# Altium project MAINBOARD.PrjPcb (part 2 of 2)

## Sheet CONNECTORs.SchDoc
size 299 x 400 mm
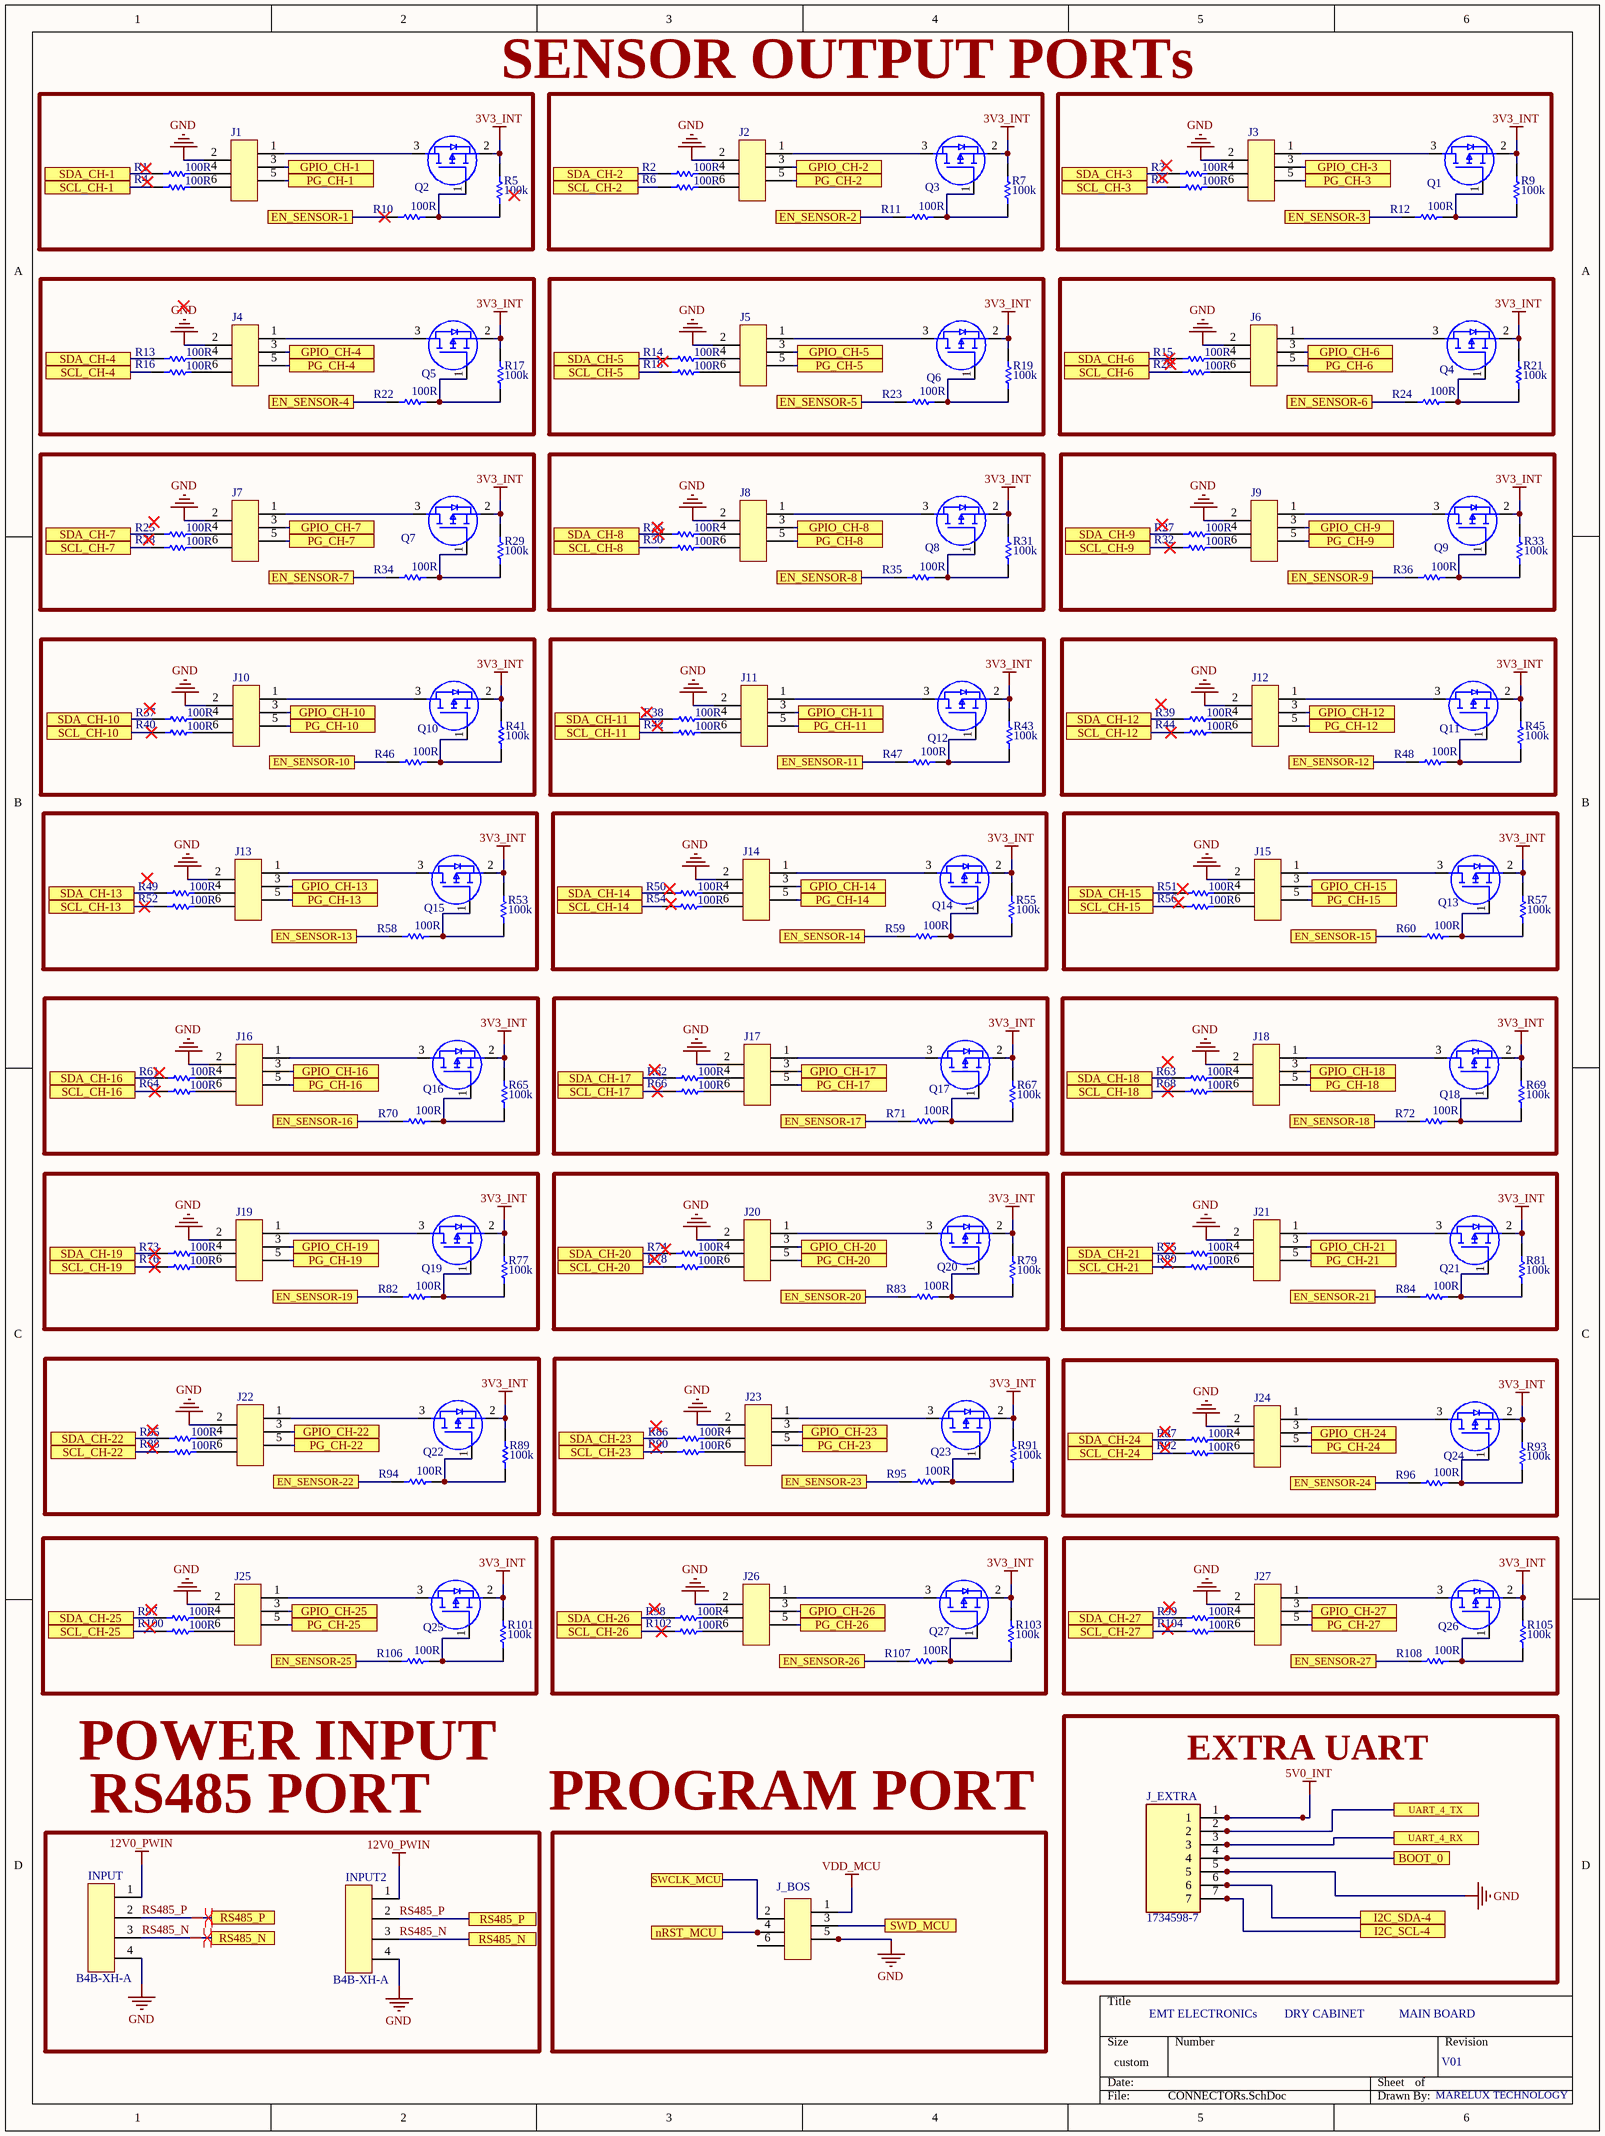
[diagram p8: CONNECTORs.SchDoc]

### Parts
INPUT  B4B-XH-A  [B4B-XH-A]
INPUT2  B4B-XH-A  [B4B-XH-A]
J1  009159006651906  [009159006651906]  (value not drawn)
J2  009159006651906  [009159006651906]  (value not drawn)
J3  009159006651906  [009159006651906]  (value not drawn)
J4  009159006651906  [009159006651906]  (value not drawn)
J5  009159006651906  [009159006651906]  (value not drawn)
J6  009159006651906  [009159006651906]  (value not drawn)
J7  009159006651906  [009159006651906]  (value not drawn)
J8  009159006651906  [009159006651906]  (value not drawn)
J9  009159006651906  [009159006651906]  (value not drawn)
J10  009159006651906  [009159006651906]  (value not drawn)
J11  009159006651906  [009159006651906]  (value not drawn)
J12  009159006651906  [009159006651906]  (value not drawn)
J13  009159006651906  [009159006651906]  (value not drawn)
J14  009159006651906  [009159006651906]  (value not drawn)
J15  009159006651906  [009159006651906]  (value not drawn)
J16  009159006651906  [009159006651906]  (value not drawn)
J17  009159006651906  [009159006651906]  (value not drawn)
J18  009159006651906  [009159006651906]  (value not drawn)
J19  009159006651906  [009159006651906]  (value not drawn)
J20  009159006651906  [009159006651906]  (value not drawn)
J21  009159006651906  [009159006651906]  (value not drawn)
J22  009159006651906  [009159006651906]  (value not drawn)
J23  009159006651906  [009159006651906]  (value not drawn)
J24  009159006651906  [009159006651906]  (value not drawn)
J25  009159006651906  [009159006651906]  (value not drawn)
J26  009159006651906  [009159006651906]  (value not drawn)
J27  009159006651906  [009159006651906]  (value not drawn)
J_BOS  009159006651906  [009159006651906]  (value not drawn)
J_EXTRA  1734598-7  [TE_1734598-7]
Q1  GSF3407  [SOT-23]  (value not drawn)
Q2  GSF3407  [SOT-23]  (value not drawn)
Q3  GSF3407  [SOT-23]  (value not drawn)
Q4  GSF3407  [SOT-23]  (value not drawn)
Q5  GSF3407  [SOT-23]  (value not drawn)
Q6  GSF3407  [SOT-23]  (value not drawn)
Q7  GSF3407  [SOT-23]  (value not drawn)
Q8  GSF3407  [SOT-23]  (value not drawn)
Q9  GSF3407  [SOT-23]  (value not drawn)
Q10  GSF3407  [SOT-23]  (value not drawn)
Q11  GSF3407  [SOT-23]  (value not drawn)
Q12  GSF3407  [SOT-23]  (value not drawn)
Q13  GSF3407  [SOT-23]  (value not drawn)
Q14  GSF3407  [SOT-23]  (value not drawn)
Q15  GSF3407  [SOT-23]  (value not drawn)
Q16  GSF3407  [SOT-23]  (value not drawn)
Q17  GSF3407  [SOT-23]  (value not drawn)
Q18  GSF3407  [SOT-23]  (value not drawn)
Q19  GSF3407  [SOT-23]  (value not drawn)
Q20  GSF3407  [SOT-23]  (value not drawn)
Q21  GSF3407  [SOT-23]  (value not drawn)
Q22  GSF3407  [SOT-23]  (value not drawn)
Q23  GSF3407  [SOT-23]  (value not drawn)
Q24  GSF3407  [SOT-23]  (value not drawn)
Q25  GSF3407  [SOT-23]  (value not drawn)
Q26  GSF3407  [SOT-23]  (value not drawn)
Q27  GSF3407  [SOT-23]  (value not drawn)
R1  value 100R  [RES_0402_SMD]  (hidden comment: RMCF0402JT100R)
R2  value 100R  [RES_0402_SMD]  (hidden comment: RMCF0402JT100R)
R3  value 100R  [RES_0402_SMD]  (hidden comment: RMCF0402JT100R)
R4  value 100R  [RES_0402_SMD]  (hidden comment: RMCF0402JT100R)
R5  value 100k  [RES_0402_SMD]  (hidden comment: RMCF0402JT100K)
R6  value 100R  [RES_0402_SMD]  (hidden comment: RMCF0402JT100R)
R7  value 100k  [RES_0402_SMD]  (hidden comment: RMCF0402JT100K)
R8  value 100R  [RES_0402_SMD]  (hidden comment: RMCF0402JT100R)
R9  value 100k  [RES_0402_SMD]  (hidden comment: RMCF0402JT100K)
R10  value 100R  [RES_0402_SMD]  (hidden comment: RMCF0402JT100R)
R11  value 100R  [RES_0402_SMD]  (hidden comment: RMCF0402JT100R)
R12  value 100R  [RES_0402_SMD]  (hidden comment: RMCF0402JT100R)
R13  value 100R  [RES_0402_SMD]  (hidden comment: RMCF0402JT100R)
R14  value 100R  [RES_0402_SMD]  (hidden comment: RMCF0402JT100R)
R15  value 100R  [RES_0402_SMD]  (hidden comment: RMCF0402JT100R)
R16  value 100R  [RES_0402_SMD]  (hidden comment: RMCF0402JT100R)
R17  value 100k  [RES_0402_SMD]  (hidden comment: RMCF0402JT100K)
R18  value 100R  [RES_0402_SMD]  (hidden comment: RMCF0402JT100R)
R19  value 100k  [RES_0402_SMD]  (hidden comment: RMCF0402JT100K)
R20  value 100R  [RES_0402_SMD]  (hidden comment: RMCF0402JT100R)
R21  value 100k  [RES_0402_SMD]  (hidden comment: RMCF0402JT100K)
R22  value 100R  [RES_0402_SMD]  (hidden comment: RMCF0402JT100R)
R23  value 100R  [RES_0402_SMD]  (hidden comment: RMCF0402JT100R)
R24  value 100R  [RES_0402_SMD]  (hidden comment: RMCF0402JT100R)
R25  value 100R  [RES_0402_SMD]  (hidden comment: RMCF0402JT100R)
R26  value 100R  [RES_0402_SMD]  (hidden comment: RMCF0402JT100R)
R27  value 100R  [RES_0402_SMD]  (hidden comment: RMCF0402JT100R)
R28  value 100R  [RES_0402_SMD]  (hidden comment: RMCF0402JT100R)
R29  value 100k  [RES_0402_SMD]  (hidden comment: RMCF0402JT100K)
R30  value 100R  [RES_0402_SMD]  (hidden comment: RMCF0402JT100R)
R31  value 100k  [RES_0402_SMD]  (hidden comment: RMCF0402JT100K)
R32  value 100R  [RES_0402_SMD]  (hidden comment: RMCF0402JT100R)
R33  value 100k  [RES_0402_SMD]  (hidden comment: RMCF0402JT100K)
R34  value 100R  [RES_0402_SMD]  (hidden comment: RMCF0402JT100R)
R35  value 100R  [RES_0402_SMD]  (hidden comment: RMCF0402JT100R)
R36  value 100R  [RES_0402_SMD]  (hidden comment: RMCF0402JT100R)
R37  value 100R  [RES_0402_SMD]  (hidden comment: RMCF0402JT100R)
R38  value 100R  [RES_0402_SMD]  (hidden comment: RMCF0402JT100R)
R39  value 100R  [RES_0402_SMD]  (hidden comment: RMCF0402JT100R)
R40  value 100R  [RES_0402_SMD]  (hidden comment: RMCF0402JT100R)
R41  value 100k  [RES_0402_SMD]  (hidden comment: RMCF0402JT100K)
R42  value 100R  [RES_0402_SMD]  (hidden comment: RMCF0402JT100R)
R43  value 100k  [RES_0402_SMD]  (hidden comment: RMCF0402JT100K)
R44  value 100R  [RES_0402_SMD]  (hidden comment: RMCF0402JT100R)
R45  value 100k  [RES_0402_SMD]  (hidden comment: RMCF0402JT100K)
R46  value 100R  [RES_0402_SMD]  (hidden comment: RMCF0402JT100R)
R47  value 100R  [RES_0402_SMD]  (hidden comment: RMCF0402JT100R)
R48  value 100R  [RES_0402_SMD]  (hidden comment: RMCF0402JT100R)
R49  value 100R  [RES_0402_SMD]  (hidden comment: RMCF0402JT100R)
R50  value 100R  [RES_0402_SMD]  (hidden comment: RMCF0402JT100R)
R51  value 100R  [RES_0402_SMD]  (hidden comment: RMCF0402JT100R)
R52  value 100R  [RES_0402_SMD]  (hidden comment: RMCF0402JT100R)
R53  value 100k  [RES_0402_SMD]  (hidden comment: RMCF0402JT100K)
R54  value 100R  [RES_0402_SMD]  (hidden comment: RMCF0402JT100R)
R55  value 100k  [RES_0402_SMD]  (hidden comment: RMCF0402JT100K)
R56  value 100R  [RES_0402_SMD]  (hidden comment: RMCF0402JT100R)
R57  value 100k  [RES_0402_SMD]  (hidden comment: RMCF0402JT100K)
R58  value 100R  [RES_0402_SMD]  (hidden comment: RMCF0402JT100R)
R59  value 100R  [RES_0402_SMD]  (hidden comment: RMCF0402JT100R)
R60  value 100R  [RES_0402_SMD]  (hidden comment: RMCF0402JT100R)
R61  value 100R  [RES_0402_SMD]  (hidden comment: RMCF0402JT100R)
R62  value 100R  [RES_0402_SMD]  (hidden comment: RMCF0402JT100R)
R63  value 100R  [RES_0402_SMD]  (hidden comment: RMCF0402JT100R)
R64  value 100R  [RES_0402_SMD]  (hidden comment: RMCF0402JT100R)
R65  value 100k  [RES_0402_SMD]  (hidden comment: RMCF0402JT100K)
R66  value 100R  [RES_0402_SMD]  (hidden comment: RMCF0402JT100R)
R67  value 100k  [RES_0402_SMD]  (hidden comment: RMCF0402JT100K)
R68  value 100R  [RES_0402_SMD]  (hidden comment: RMCF0402JT100R)
R69  value 100k  [RES_0402_SMD]  (hidden comment: RMCF0402JT100K)
R70  value 100R  [RES_0402_SMD]  (hidden comment: RMCF0402JT100R)
R71  value 100R  [RES_0402_SMD]  (hidden comment: RMCF0402JT100R)
R72  value 100R  [RES_0402_SMD]  (hidden comment: RMCF0402JT100R)
R73  value 100R  [RES_0402_SMD]  (hidden comment: RMCF0402JT100R)
R74  value 100R  [RES_0402_SMD]  (hidden comment: RMCF0402JT100R)
R75  value 100R  [RES_0402_SMD]  (hidden comment: RMCF0402JT100R)
R76  value 100R  [RES_0402_SMD]  (hidden comment: RMCF0402JT100R)
R77  value 100k  [RES_0402_SMD]  (hidden comment: RMCF0402JT100K)
R78  value 100R  [RES_0402_SMD]  (hidden comment: RMCF0402JT100R)
R79  value 100k  [RES_0402_SMD]  (hidden comment: RMCF0402JT100K)
R80  value 100R  [RES_0402_SMD]  (hidden comment: RMCF0402JT100R)
R81  value 100k  [RES_0402_SMD]  (hidden comment: RMCF0402JT100K)
R82  value 100R  [RES_0402_SMD]  (hidden comment: RMCF0402JT100R)
R83  value 100R  [RES_0402_SMD]  (hidden comment: RMCF0402JT100R)
R84  value 100R  [RES_0402_SMD]  (hidden comment: RMCF0402JT100R)
R85  value 100R  [RES_0402_SMD]  (hidden comment: RMCF0402JT100R)
R86  value 100R  [RES_0402_SMD]  (hidden comment: RMCF0402JT100R)
R87  value 100R  [RES_0402_SMD]  (hidden comment: RMCF0402JT100R)
R88  value 100R  [RES_0402_SMD]  (hidden comment: RMCF0402JT100R)
R89  value 100k  [RES_0402_SMD]  (hidden comment: RMCF0402JT100K)
R90  value 100R  [RES_0402_SMD]  (hidden comment: RMCF0402JT100R)
R91  value 100k  [RES_0402_SMD]  (hidden comment: RMCF0402JT100K)
R92  value 100R  [RES_0402_SMD]  (hidden comment: RMCF0402JT100R)
R93  value 100k  [RES_0402_SMD]  (hidden comment: RMCF0402JT100K)
R94  value 100R  [RES_0402_SMD]  (hidden comment: RMCF0402JT100R)
R95  value 100R  [RES_0402_SMD]  (hidden comment: RMCF0402JT100R)
R96  value 100R  [RES_0402_SMD]  (hidden comment: RMCF0402JT100R)
R97  value 100R  [RES_0402_SMD]  (hidden comment: RMCF0402JT100R)
R98  value 100R  [RES_0402_SMD]  (hidden comment: RMCF0402JT100R)
R99  value 100R  [RES_0402_SMD]  (hidden comment: RMCF0402JT100R)
R100  value 100R  [RES_0402_SMD]  (hidden comment: RMCF0402JT100R)
R101  value 100k  [RES_0402_SMD]  (hidden comment: RMCF0402JT100K)
R102  value 100R  [RES_0402_SMD]  (hidden comment: RMCF0402JT100R)
R103  value 100k  [RES_0402_SMD]  (hidden comment: RMCF0402JT100K)
R104  value 100R  [RES_0402_SMD]  (hidden comment: RMCF0402JT100R)
R105  value 100k  [RES_0402_SMD]  (hidden comment: RMCF0402JT100K)
R106  value 100R  [RES_0402_SMD]  (hidden comment: RMCF0402JT100R)
R107  value 100R  [RES_0402_SMD]  (hidden comment: RMCF0402JT100R)
R108  value 100R  [RES_0402_SMD]  (hidden comment: RMCF0402JT100R)

### Blocks framed on the sheet
SENSOR OUTPUT PORTs: J1 Q2 R1 R4 R5 R10
EXTRA UART: J_EXTRA
RS485 PORT: INPUT INPUT2

### Ports
BOOT_0, EN_SENSOR-1, EN_SENSOR-2, EN_SENSOR-3, EN_SENSOR-4, EN_SENSOR-5, EN_SENSOR-6, EN_SENSOR-7, EN_SENSOR-8, EN_SENSOR-9, EN_SENSOR-10, EN_SENSOR-11, EN_SENSOR-12, EN_SENSOR-13, EN_SENSOR-14, EN_SENSOR-15, EN_SENSOR-16, EN_SENSOR-17, EN_SENSOR-18, EN_SENSOR-19, EN_SENSOR-20, EN_SENSOR-21, EN_SENSOR-22, EN_SENSOR-23, EN_SENSOR-24, EN_SENSOR-25, EN_SENSOR-26, EN_SENSOR-27, GPIO_CH-1, GPIO_CH-2, GPIO_CH-3, GPIO_CH-4, GPIO_CH-5, GPIO_CH-6, GPIO_CH-7, GPIO_CH-8, GPIO_CH-9, GPIO_CH-10, GPIO_CH-11, GPIO_CH-12, GPIO_CH-13, GPIO_CH-14, GPIO_CH-15, GPIO_CH-16, GPIO_CH-17, GPIO_CH-18, GPIO_CH-19, GPIO_CH-20, GPIO_CH-21, GPIO_CH-22, GPIO_CH-23, GPIO_CH-24, GPIO_CH-25, GPIO_CH-26, GPIO_CH-27, I2C_SCL-4, I2C_SDA-4, nRST_MCU, PG_CH-1, PG_CH-2, PG_CH-3, PG_CH-4, PG_CH-5, PG_CH-6, PG_CH-7, PG_CH-8, PG_CH-9, PG_CH-10, PG_CH-11, PG_CH-12, PG_CH-13, PG_CH-14, PG_CH-15, PG_CH-16, PG_CH-17, PG_CH-18, PG_CH-19, PG_CH-20, PG_CH-21, PG_CH-22, PG_CH-23, PG_CH-24, PG_CH-25, PG_CH-26, PG_CH-27, RS485_N, RS485_P, SCL_CH-1, SCL_CH-2, SCL_CH-3, SCL_CH-4, SCL_CH-5, SCL_CH-6, SCL_CH-7, SCL_CH-8, SCL_CH-9, SCL_CH-10, SCL_CH-11, SCL_CH-12, SCL_CH-13, SCL_CH-14, SCL_CH-15, SCL_CH-16, SCL_CH-17, SCL_CH-18, SCL_CH-19, SCL_CH-20, SCL_CH-21, SCL_CH-22, SCL_CH-23, SCL_CH-24, SCL_CH-25, SCL_CH-26, SCL_CH-27, SDA_CH-1, SDA_CH-2, SDA_CH-3, SDA_CH-4, SDA_CH-5, SDA_CH-6, SDA_CH-7, SDA_CH-8, SDA_CH-9, SDA_CH-10, SDA_CH-11, SDA_CH-12, SDA_CH-13, SDA_CH-14, SDA_CH-15, SDA_CH-16, SDA_CH-17, SDA_CH-18, SDA_CH-19, SDA_CH-20, SDA_CH-21, SDA_CH-22, SDA_CH-23, SDA_CH-24, SDA_CH-25, SDA_CH-26, SDA_CH-27, SWCLK_MCU, SWD_MCU, UART_4_RX, UART_4_TX

### Nets
3V3_INT: Q1.2(S) Q2.2(S) Q3.2(S) Q4.2(S) Q5.2(S) Q6.2(S) Q7.2(S) Q8.2(S) Q9.2(S) Q10.2(S) Q11.2(S) Q12.2(S) Q13.2(S) Q14.2(S) Q15.2(S) Q16.2(S) Q17.2(S) Q18.2(S) Q19.2(S) Q20.2(S) Q21.2(S) Q22.2(S) Q23.2(S) Q24.2(S) Q25.2(S) Q26.2(S) Q27.2(S) R5.2 R7.2 R9.2 R17.2 R19.2 R21.2 R29.2 R31.2 R33.2 R41.2 R43.2 R45.2 R53.2 R55.2 R57.2 R65.2 R67.2 R69.2 R77.2 R79.2 R81.2 R89.2 R91.2 R93.2 R101.2 R103.2 R105.2
5V0_INT: J_EXTRA.1
12V0_PWIN: INPUT.1 INPUT2.1
GND: INPUT.4 INPUT2.4 J1.2 J2.2 J3.2 J4.2 J5.2 J6.2 J7.2 J8.2 J9.2 J10.2 J11.2 J12.2 J13.2 J14.2 J15.2 J16.2 J17.2 J18.2 J19.2 J20.2 J21.2 J22.2 J23.2 J24.2 J25.2 J26.2 J27.2 J_BOS.5 J_EXTRA.5
VDD_MCU: J_BOS.1
I2C_SCL-4: J_EXTRA.7 ; port I2C_SCL-4
I2C_SDA-4: J_EXTRA.6 ; port I2C_SDA-4
RS485_N: INPUT.3 INPUT2.3 ; port RS485_N
RS485_P: INPUT.2 INPUT2.2 ; port RS485_P
NetC29_2: J_BOS.4 ; port nRST_MCU
NetJ1_1: J1.1 Q2.3(D)
NetJ1_3: J1.3 ; port GPIO_CH-1
NetJ1_4: J1.4 R1.1
NetJ1_5: J1.5 ; port PG_CH-1
NetJ1_6: J1.6 R4.1
NetJ2_1: J2.1 Q3.3(D)
NetJ2_3: J2.3 ; port GPIO_CH-2
NetJ2_4: J2.4 R2.1
NetJ2_5: J2.5 ; port PG_CH-2
NetJ2_6: J2.6 R6.1
NetJ3_1: J3.1 Q1.3(D)
NetJ3_3: J3.3 ; port GPIO_CH-3
NetJ3_4: J3.4 R3.1
NetJ3_5: J3.5 ; port PG_CH-3
NetJ3_6: J3.6 R8.1
NetJ4_1: J4.1 Q5.3(D)
NetJ4_3: J4.3 ; port GPIO_CH-4
NetJ4_4: J4.4 R13.1
NetJ4_5: J4.5 ; port PG_CH-4
NetJ4_6: J4.6 R16.1
NetJ5_1: J5.1 Q6.3(D)
NetJ5_3: J5.3 ; port GPIO_CH-5
NetJ5_4: J5.4 R14.1
NetJ5_5: J5.5 ; port PG_CH-5
NetJ5_6: J5.6 R18.1
NetJ6_1: J6.1 Q4.3(D)
NetJ6_3: J6.3 ; port GPIO_CH-6
NetJ6_4: J6.4 R15.1
NetJ6_5: J6.5 ; port PG_CH-6
NetJ6_6: J6.6 R20.1
NetJ7_1: J7.1 Q7.3(D)
NetJ7_3: J7.3 ; port GPIO_CH-7
NetJ7_4: J7.4 R25.1
NetJ7_5: J7.5 ; port PG_CH-7
NetJ7_6: J7.6 R28.1
NetJ8_1: J8.1 Q8.3(D)
NetJ8_3: J8.3 ; port GPIO_CH-8
NetJ8_4: J8.4 R26.1
NetJ8_5: J8.5 ; port PG_CH-8
NetJ8_6: J8.6 R30.1
NetJ9_1: J9.1 Q9.3(D)
NetJ9_3: J9.3 ; port GPIO_CH-9
NetJ9_4: J9.4 R27.1
NetJ9_5: J9.5 ; port PG_CH-9
NetJ9_6: J9.6 R32.1
NetJ10_1: J10.1 Q10.3(D)
NetJ10_3: J10.3 ; port GPIO_CH-10
NetJ10_4: J10.4 R37.1
NetJ10_5: J10.5 ; port PG_CH-10
NetJ10_6: J10.6 R40.1
NetJ11_1: J11.1 Q12.3(D)
NetJ11_3: J11.3 ; port GPIO_CH-11
NetJ11_4: J11.4 R38.1
NetJ11_5: J11.5 ; port PG_CH-11
NetJ11_6: J11.6 R42.1
NetJ12_1: J12.1 Q11.3(D)
NetJ12_3: J12.3 ; port GPIO_CH-12
NetJ12_4: J12.4 R39.1
NetJ12_5: J12.5 ; port PG_CH-12
NetJ12_6: J12.6 R44.1
NetJ13_1: J13.1 Q15.3(D)
NetJ13_3: J13.3 ; port GPIO_CH-13
NetJ13_4: J13.4 R49.1
NetJ13_5: J13.5 ; port PG_CH-13
NetJ13_6: J13.6 R52.1
NetJ14_1: J14.1 Q14.3(D)
NetJ14_3: J14.3 ; port GPIO_CH-14
NetJ14_4: J14.4 R50.1
NetJ14_5: J14.5 ; port PG_CH-14
NetJ14_6: J14.6 R54.1
NetJ15_1: J15.1 Q13.3(D)
NetJ15_3: J15.3 ; port GPIO_CH-15
NetJ15_4: J15.4 R51.1
NetJ15_5: J15.5 ; port PG_CH-15
NetJ15_6: J15.6 R56.1
NetJ16_1: J16.1 Q16.3(D)
NetJ16_3: J16.3 ; port GPIO_CH-16
NetJ16_4: J16.4 R61.1
NetJ16_5: J16.5 ; port PG_CH-16
NetJ16_6: J16.6 R64.1
NetJ17_1: J17.1 Q17.3(D)
NetJ17_3: J17.3 ; port GPIO_CH-17
NetJ17_4: J17.4 R62.1
NetJ17_5: J17.5 ; port PG_CH-17
NetJ17_6: J17.6 R66.1
NetJ18_1: J18.1 Q18.3(D)
NetJ18_3: J18.3 ; port GPIO_CH-18
NetJ18_4: J18.4 R63.1
NetJ18_5: J18.5 ; port PG_CH-18
NetJ18_6: J18.6 R68.1
NetJ19_1: J19.1 Q19.3(D)
NetJ19_3: J19.3 ; port GPIO_CH-19
NetJ19_4: J19.4 R73.1
NetJ19_5: J19.5 ; port PG_CH-19
NetJ19_6: J19.6 R76.1
NetJ20_1: J20.1 Q20.3(D)
NetJ20_3: J20.3 ; port GPIO_CH-20
NetJ20_4: J20.4 R74.1
NetJ20_5: J20.5 ; port PG_CH-20
NetJ20_6: J20.6 R78.1
NetJ21_1: J21.1 Q21.3(D)
NetJ21_3: J21.3 ; port GPIO_CH-21
NetJ21_4: J21.4 R75.1
NetJ21_5: J21.5 ; port PG_CH-21
NetJ21_6: J21.6 R80.1
NetJ22_1: J22.1 Q22.3(D)
NetJ22_3: J22.3 ; port GPIO_CH-22
NetJ22_4: J22.4 R85.1
NetJ22_5: J22.5 ; port PG_CH-22
NetJ22_6: J22.6 R88.1
NetJ23_1: J23.1 Q23.3(D)
NetJ23_3: J23.3 ; port GPIO_CH-23
NetJ23_4: J23.4 R86.1
NetJ23_5: J23.5 ; port PG_CH-23
NetJ23_6: J23.6 R90.1
NetJ24_1: J24.1 Q24.3(D)
NetJ24_3: J24.3 ; port GPIO_CH-24
NetJ24_4: J24.4 R87.1
NetJ24_5: J24.5 ; port PG_CH-24
NetJ24_6: J24.6 R92.1
NetJ25_1: J25.1 Q25.3(D)
NetJ25_3: J25.3 ; port GPIO_CH-25
NetJ25_4: J25.4 R97.1
NetJ25_5: J25.5 ; port PG_CH-25
NetJ25_6: J25.6 R100.1
NetJ26_1: J26.1 Q27.3(D)
NetJ26_3: J26.3 ; port GPIO_CH-26
NetJ26_4: J26.4 R98.1
NetJ26_5: J26.5 ; port PG_CH-26
NetJ26_6: J26.6 R102.1
NetJ27_1: J27.1 Q26.3(D)
NetJ27_3: J27.3 ; port GPIO_CH-27
NetJ27_4: J27.4 R99.1
NetJ27_5: J27.5 ; port PG_CH-27
NetJ27_6: J27.6 R104.1
NetJ_BOS_2: J_BOS.2 ; port SWCLK_MCU
NetJ_BOS_3: J_BOS.3 ; port SWD_MCU
NetJ_EXTRA_2: J_EXTRA.2 ; port UART_4_TX
NetJ_EXTRA_3: J_EXTRA.3 ; port UART_4_RX
NetJ_EXTRA_4: J_EXTRA.4 ; port BOOT_0
NetQ1_1: Q1.1(G) R9.1 R12.1
NetQ2_1: Q2.1(G) R5.1 R10.1
NetQ3_1: Q3.1(G) R7.1 R11.1
NetQ4_1: Q4.1(G) R21.1 R24.1
NetQ5_1: Q5.1(G) R17.1 R22.1
NetQ6_1: Q6.1(G) R19.1 R23.1
NetQ7_1: Q7.1(G) R29.1 R34.1
NetQ8_1: Q8.1(G) R31.1 R35.1
NetQ9_1: Q9.1(G) R33.1 R36.1
NetQ10_1: Q10.1(G) R41.1 R46.1
NetQ11_1: Q11.1(G) R45.1 R48.1
NetQ12_1: Q12.1(G) R43.1 R47.1
NetQ13_1: Q13.1(G) R57.1 R60.1
NetQ14_1: Q14.1(G) R55.1 R59.1
NetQ15_1: Q15.1(G) R53.1 R58.1
NetQ16_1: Q16.1(G) R65.1 R70.1
NetQ17_1: Q17.1(G) R67.1 R71.1
NetQ18_1: Q18.1(G) R69.1 R72.1
NetQ19_1: Q19.1(G) R77.1 R82.1
NetQ20_1: Q20.1(G) R79.1 R83.1
NetQ21_1: Q21.1(G) R81.1 R84.1
NetQ22_1: Q22.1(G) R89.1 R94.1
NetQ23_1: Q23.1(G) R91.1 R95.1
NetQ24_1: Q24.1(G) R93.1 R96.1
NetQ25_1: Q25.1(G) R101.1 R106.1
NetQ26_1: Q26.1(G) R105.1 R108.1
NetQ27_1: Q27.1(G) R103.1 R107.1
NetR1_2: R1.2 ; port SDA_CH-1
NetR2_2: R2.2 ; port SDA_CH-2
NetR3_2: R3.2 ; port SDA_CH-3
NetR4_2: R4.2 ; port SCL_CH-1
NetR6_2: R6.2 ; port SCL_CH-2
NetR8_2: R8.2 ; port SCL_CH-3
NetR10_2: R10.2 ; port EN_SENSOR-1
NetR11_2: R11.2 ; port EN_SENSOR-2
NetR12_2: R12.2 ; port EN_SENSOR-3
NetR13_2: R13.2 ; port SDA_CH-4
NetR14_2: R14.2 ; port SDA_CH-5
NetR15_2: R15.2 ; port SDA_CH-6
NetR16_2: R16.2 ; port SCL_CH-4
NetR18_2: R18.2 ; port SCL_CH-5
NetR20_2: R20.2 ; port SCL_CH-6
NetR22_2: R22.2 ; port EN_SENSOR-4
NetR23_2: R23.2 ; port EN_SENSOR-5
NetR24_2: R24.2 ; port EN_SENSOR-6
NetR25_2: R25.2 ; port SDA_CH-7
NetR26_2: R26.2 ; port SDA_CH-8
NetR27_2: R27.2 ; port SDA_CH-9
NetR28_2: R28.2 ; port SCL_CH-7
NetR30_2: R30.2 ; port SCL_CH-8
NetR32_2: R32.2 ; port SCL_CH-9
NetR34_2: R34.2 ; port EN_SENSOR-7
NetR35_2: R35.2 ; port EN_SENSOR-8
NetR36_2: R36.2 ; port EN_SENSOR-9
NetR37_2: R37.2 ; port SDA_CH-10
NetR38_2: R38.2 ; port SDA_CH-11
NetR39_2: R39.2 ; port SDA_CH-12
NetR40_2: R40.2 ; port SCL_CH-10
NetR42_2: R42.2 ; port SCL_CH-11
NetR44_2: R44.2 ; port SCL_CH-12
NetR46_2: R46.2 ; port EN_SENSOR-10
NetR47_2: R47.2 ; port EN_SENSOR-11
NetR48_2: R48.2 ; port EN_SENSOR-12
NetR49_2: R49.2 ; port SDA_CH-13
NetR50_2: R50.2 ; port SDA_CH-14
NetR51_2: R51.2 ; port SDA_CH-15
NetR52_2: R52.2 ; port SCL_CH-13
NetR54_2: R54.2 ; port SCL_CH-14
NetR56_2: R56.2 ; port SCL_CH-15
NetR58_2: R58.2 ; port EN_SENSOR-13
NetR59_2: R59.2 ; port EN_SENSOR-14
NetR60_2: R60.2 ; port EN_SENSOR-15
NetR61_2: R61.2 ; port SDA_CH-16
NetR62_2: R62.2 ; port SDA_CH-17
NetR63_2: R63.2 ; port SDA_CH-18
NetR64_2: R64.2 ; port SCL_CH-16
NetR66_2: R66.2 ; port SCL_CH-17
NetR68_2: R68.2 ; port SCL_CH-18
NetR70_2: R70.2 ; port EN_SENSOR-16
NetR71_2: R71.2 ; port EN_SENSOR-17
NetR72_2: R72.2 ; port EN_SENSOR-18
NetR73_2: R73.2 ; port SDA_CH-19
NetR74_2: R74.2 ; port SDA_CH-20
NetR75_2: R75.2 ; port SDA_CH-21
NetR76_2: R76.2 ; port SCL_CH-19
NetR78_2: R78.2 ; port SCL_CH-20
NetR80_2: R80.2 ; port SCL_CH-21
NetR82_2: R82.2 ; port EN_SENSOR-19
NetR83_2: R83.2 ; port EN_SENSOR-20
NetR84_2: R84.2 ; port EN_SENSOR-21
NetR85_2: R85.2 ; port SDA_CH-22
NetR86_2: R86.2 ; port SDA_CH-23
NetR87_2: R87.2 ; port SDA_CH-24
NetR88_2: R88.2 ; port SCL_CH-22
NetR90_2: R90.2 ; port SCL_CH-23
NetR92_2: R92.2 ; port SCL_CH-24
NetR94_2: R94.2 ; port EN_SENSOR-22
NetR95_2: R95.2 ; port EN_SENSOR-23
NetR96_2: R96.2 ; port EN_SENSOR-24
NetR97_2: R97.2 ; port SDA_CH-25
NetR98_2: R98.2 ; port SDA_CH-26
NetR99_2: R99.2 ; port SDA_CH-27
NetR100_2: R100.2 ; port SCL_CH-25
NetR102_2: R102.2 ; port SCL_CH-26
NetR104_2: R104.2 ; port SCL_CH-27
NetR106_2: R106.2 ; port EN_SENSOR-25
NetR107_2: R107.2 ; port EN_SENSOR-26
NetR108_2: R108.2 ; port EN_SENSOR-27

Not connected (* = marked no-connect by the designer): J_BOS 6

### Layout directives
differential pair: RS485_N, RS485_P

### Notes on the sheet
- (near R106) POWER INPUT
- PROGRAM PORT

### Library data of the parts
INPUT INPUT2 = B4B-XH-A: CONN HEADER VERT 4POS 2.5MM; Manufacturer: JST; Place: POP; Part Number: B4B-XH-A; Value: 4pos; Voltage: N/A; Power: N/A; Tolerance: N/A; Package: B4B-XH-A; Operating Temp.: N/A
J1-J27 J_BOS = 009159006651906: CONN EDGE DUAL FMALE 6POS 0.024; Manufacturer: KYOCERA AVX; Place: POP; Value: N/A; Voltage: N/A; Power: N/A; Tolerance: N/A; Package: Special; Operating Temp.: -40~+85; Part Number: 009159006651906
J_EXTRA = 1734598-7: Connector Header Through Hole 7 position 0.049 (1.25mm); MF: TE Connectivity; Package: None; DigiKey-Purchase-URL: https://snapeda.com/shop?store=DigiKey&id=2374857; Value: *; MP: 1734598-7; Mouser-Purchase-URL: https://snapeda.com/shop?store=Mouser&id=2374857; Digi-Key_Part_Number: A99919-ND; EU_RoHS_Compliance: Compliant; SnapEDA_Link: https://www.snapeda.com/parts/1734598-7/TE%20Connectivity%20AMP%20Connectors/view-part/2374857/?ref=snap
Q1-Q27 = GSF3407: P-Channel 30 V 4.1A (Ta) 1.2W (Ta) Surface Mount SOT-23; Manufacturer: Good-Ark Semiconductor; Voltage: 30 V; Power: 1200 mW; Place: POP; Part Number: GSF3407; Value: N/A; Tolerance: N/A; Package: SOT-23; Operating Temp.: -55°C ~ 150°C
R1-R4 R6 R8 R10-R16 R18 R20 R22-R28 R30 R32 R34-R40 R42 R44 R46-R52 R54 R56 R58-R64 R66 R68 R70-R76 R78 R80 R82-R88 R90 R92 R94-R100 R102 R104 R106-R108 = RES_GEN_SMD: Generic Chip Res 100R; Tolerance: 5 %; Place: POP; Package: *; Part Number: RMCF0402JT100R; Power: *; Voltage: *; Operating Temp.: *
R5 R7 R9 R17 R19 R21 R29 R31 R33 R41 R43 R45 R53 R55 R57 R65 R67 R69 R77 R79 R81 R89 R91 R93 R101 R103 R105 = RES_GEN_SMD: Generic Chip Res 158k; Tolerance: 5%; Place: POP; Package: 0402; Part Number: RMCF0402JT100K; Power: *; Voltage: *; Operating Temp.: *

## Nets that join several sheets
3V3_INT: POWER (5 pins), MICROCONTROLLER (L1.1), I2C SWITCH (28 pins), MISC (12 pins), CONNECTORs (54 pins)
5V0_INT: POWER (7 pins), RGB LEDs (36 pins), RGB_LED_2 (36 pins), RGB_LED_3 (11 pins), MISC (C33.2 R1002.1 U7.8), CONNECTORs (J_EXTRA.1)
12V0_PWIN: POWER (R150.1 R1150.1), CONNECTORs (INPUT.1 INPUT2.1)
GND: POWER (11 pins), MICROCONTROLLER (42 pins), I2C SWITCH (20 pins), RGB LEDs (36 pins), RGB_LED_2 (36 pins), RGB_LED_3 (11 pins), MISC (18 pins), CONNECTORs (31 pins)
VDD_MCU: MICROCONTROLLER (41 pins), CONNECTORs (J_BOS.1)
I2C_SCL-1: MICROCONTROLLER (U5.136), I2C SWITCH (R161.1 U1.22)
I2C_SCL-2: MICROCONTROLLER (U5.11), I2C SWITCH (R163.1 U2.22)
I2C_SCL-3: MICROCONTROLLER (U5.100), I2C SWITCH (R165.1 U3.22)
I2C_SCL-4: MICROCONTROLLER (U5.81), I2C SWITCH (R166.1 U4.22), MISC (R137.1 U6.6), CONNECTORs (J_EXTRA.7)
I2C_SDA-1: MICROCONTROLLER (U5.137), I2C SWITCH (R160.1 U1.23)
I2C_SDA-2: MICROCONTROLLER (U5.10), I2C SWITCH (R162.1 U2.23)
I2C_SDA-3: MICROCONTROLLER (U5.99), I2C SWITCH (R164.1 U3.23)
I2C_SDA-4: MICROCONTROLLER (U5.82), I2C SWITCH (R167.1 U4.23), MISC (R136.1 U6.5), CONNECTORs (J_EXTRA.6)
NetC29_2: MICROCONTROLLER (C29.2 R135.1 U5.25), CONNECTORs (J_BOS.4)
NetDEVICE_ID_1: MICROCONTROLLER (U5.45), MISC (DEVICE_ID.1 R145.2)
NetDEVICE_ID_2: MICROCONTROLLER (U5.46), MISC (DEVICE_ID.2 R144.2)
NetDEVICE_ID_3: MICROCONTROLLER (U5.47), MISC (DEVICE_ID.3 R143.2)
NetDEVICE_ID_4: MICROCONTROLLER (U5.48), MISC (DEVICE_ID.4 R142.2)
NetDEVICE_ID_5: MICROCONTROLLER (U5.49), MISC (DEVICE_ID.5 R141.2)
NetDEVICE_ID_6: MICROCONTROLLER (U5.50), MISC (DEVICE_ID.6 R140.2)
NetDEVICE_ID_7: MICROCONTROLLER (U5.53), MISC (DEVICE_ID.7 R139.2)
NetDEVICE_ID_8: MICROCONTROLLER (U5.54), MISC (DEVICE_ID.8 R138.2)
NetJ1_3: MICROCONTROLLER (U5.123), CONNECTORs (J1.3)
NetJ1_5: MICROCONTROLLER (U5.124), CONNECTORs (J1.5)
NetJ2_3: MICROCONTROLLER (U5.127), CONNECTORs (J2.3)
NetJ2_5: MICROCONTROLLER (U5.126), CONNECTORs (J2.5)
NetJ3_3: MICROCONTROLLER (U5.128), CONNECTORs (J3.3)
NetJ3_5: MICROCONTROLLER (U5.132), CONNECTORs (J3.5)
NetJ4_3: MICROCONTROLLER (U5.134), CONNECTORs (J4.3)
NetJ4_5: MICROCONTROLLER (U5.135), CONNECTORs (J4.5)
NetJ5_3: MICROCONTROLLER (U5.140), CONNECTORs (J5.3)
NetJ5_5: MICROCONTROLLER (U5.1), CONNECTORs (J5.5)
NetJ6_3: MICROCONTROLLER (U5.3), CONNECTORs (J6.3)
NetJ6_5: MICROCONTROLLER (U5.4), CONNECTORs (J6.5)
NetJ7_3: MICROCONTROLLER (U5.8), CONNECTORs (J7.3)
NetJ7_5: MICROCONTROLLER (U5.7), CONNECTORs (J7.5)
NetJ8_3: MICROCONTROLLER (U5.15), CONNECTORs (J8.3)
NetJ8_5: MICROCONTROLLER (U5.14), CONNECTORs (J8.5)
NetJ9_3: MICROCONTROLLER (U5.20), CONNECTORs (J9.3)
NetJ9_5: MICROCONTROLLER (U5.44), CONNECTORs (J9.5)
NetJ10_3: MICROCONTROLLER (U5.21), CONNECTORs (J10.3)
NetJ10_5: MICROCONTROLLER (U5.26), CONNECTORs (J10.5)
NetJ11_3: MICROCONTROLLER (U5.28), CONNECTORs (J11.3)
NetJ11_5: MICROCONTROLLER (U5.29), CONNECTORs (J11.5)
NetJ12_3: MICROCONTROLLER (U5.37), CONNECTORs (J12.3)
NetJ12_5: MICROCONTROLLER (U5.40), CONNECTORs (J12.5)
NetJ13_3: MICROCONTROLLER (U5.42), CONNECTORs (J13.3)
NetJ13_5: MICROCONTROLLER (U5.43), CONNECTORs (J13.5)
NetJ14_3: MICROCONTROLLER (U5.57), CONNECTORs (J14.3)
NetJ14_5: MICROCONTROLLER (U5.56), CONNECTORs (J14.5)
NetJ15_3: MICROCONTROLLER (U5.58), CONNECTORs (J15.3)
NetJ15_5: MICROCONTROLLER (U5.59), CONNECTORs (J15.5)
NetJ16_3: MICROCONTROLLER (U5.68), CONNECTORs (J16.3)
NetJ16_5: MICROCONTROLLER (U5.66), CONNECTORs (J16.5)
NetJ17_3: MICROCONTROLLER (U5.64), CONNECTORs (J17.3)
NetJ17_5: MICROCONTROLLER (U5.63), CONNECTORs (J17.5)
NetJ18_3: MICROCONTROLLER (U5.75), CONNECTORs (J18.3)
NetJ18_5: MICROCONTROLLER (U5.69), CONNECTORs (J18.5)
NetJ19_3: MICROCONTROLLER (U5.77), CONNECTORs (J19.3)
NetJ19_5: MICROCONTROLLER (U5.78), CONNECTORs (J19.5)
NetJ20_3: MICROCONTROLLER (U5.86), CONNECTORs (J20.3)
NetJ20_5: MICROCONTROLLER (U5.87), CONNECTORs (J20.5)
NetJ21_3: MICROCONTROLLER (U5.89), CONNECTORs (J21.3)
NetJ21_5: MICROCONTROLLER (U5.90), CONNECTORs (J21.5)
NetJ22_3: MICROCONTROLLER (U5.92), CONNECTORs (J22.3)
NetJ22_5: MICROCONTROLLER (U5.93), CONNECTORs (J22.5)
NetJ23_3: MICROCONTROLLER (U5.97), CONNECTORs (J23.3)
NetJ23_5: MICROCONTROLLER (U5.101), CONNECTORs (J23.5)
NetJ24_3: MICROCONTROLLER (U5.104), CONNECTORs (J24.3)
NetJ24_5: MICROCONTROLLER (U5.103), CONNECTORs (J24.5)
NetJ25_3: MICROCONTROLLER (U5.111), CONNECTORs (J25.3)
NetJ25_5: MICROCONTROLLER (U5.113), CONNECTORs (J25.5)
NetJ26_3: MICROCONTROLLER (U5.115), CONNECTORs (J26.3)
NetJ26_5: MICROCONTROLLER (U5.116), CONNECTORs (J26.5)
NetJ27_3: MICROCONTROLLER (U5.118), CONNECTORs (J27.3)
NetJ27_5: MICROCONTROLLER (U5.117), CONNECTORs (J27.5)
NetJ_BOS_2: MICROCONTROLLER (U5.109), CONNECTORs (J_BOS.2)
NetJ_BOS_3: MICROCONTROLLER (U5.105), CONNECTORs (J_BOS.3)
NetJ_EXTRA_2: MICROCONTROLLER (U5.34), CONNECTORs (J_EXTRA.2)
NetJ_EXTRA_3: MICROCONTROLLER (U5.35), CONNECTORs (J_EXTRA.3)
NetJ_EXTRA_4: MICROCONTROLLER (R133.2 R134.1 U5.138), CONNECTORs (J_EXTRA.4)
NetLED12_1: RGB LEDs (LED12.1 LED1012.3), RGB_LED_2 (LED13.3 LED1013.1)
NetLED24_1: RGB_LED_2 (LED24.1 LED1024.3), RGB_LED_3 (LED25.3 LED1025.1)
NetR1_2: I2C SWITCH (U1.4), CONNECTORs (R1.2)
NetR2_2: I2C SWITCH (U1.6), CONNECTORs (R2.2)
NetR3_2: I2C SWITCH (U1.8), CONNECTORs (R3.2)
NetR4_2: I2C SWITCH (U1.5), CONNECTORs (R4.2)
NetR6_2: I2C SWITCH (U1.7), CONNECTORs (R6.2)
NetR8_2: I2C SWITCH (U1.9), CONNECTORs (R8.2)
NetR10_2: MICROCONTROLLER (U5.122), CONNECTORs (R10.2)
NetR11_2: MICROCONTROLLER (U5.125), CONNECTORs (R11.2)
NetR12_2: MICROCONTROLLER (U5.129), CONNECTORs (R12.2)
NetR13_2: I2C SWITCH (U1.10), CONNECTORs (R13.2)
NetR14_2: I2C SWITCH (U1.13), CONNECTORs (R14.2)
NetR15_2: I2C SWITCH (U1.15), CONNECTORs (R15.2)
NetR16_2: I2C SWITCH (U1.11), CONNECTORs (R16.2)
NetR18_2: I2C SWITCH (U1.14), CONNECTORs (R18.2)
NetR20_2: I2C SWITCH (U1.16), CONNECTORs (R20.2)
NetR22_2: MICROCONTROLLER (U5.133), CONNECTORs (R22.2)
NetR23_2: MICROCONTROLLER (U5.141), CONNECTORs (R23.2)
NetR24_2: MICROCONTROLLER (U5.5), CONNECTORs (R24.2)
NetR25_2: I2C SWITCH (U1.17), CONNECTORs (R25.2)
NetR26_2: I2C SWITCH (U1.19), CONNECTORs (R26.2)
NetR27_2: I2C SWITCH (U2.4), CONNECTORs (R27.2)
NetR28_2: I2C SWITCH (U1.18), CONNECTORs (R28.2)
NetR30_2: I2C SWITCH (U1.20), CONNECTORs (R30.2)
NetR32_2: I2C SWITCH (U2.5), CONNECTORs (R32.2)
NetR34_2: MICROCONTROLLER (U5.9), CONNECTORs (R34.2)
NetR35_2: MICROCONTROLLER (U5.13), CONNECTORs (R35.2)
NetR36_2: MICROCONTROLLER (U5.18), CONNECTORs (R36.2)
NetR37_2: I2C SWITCH (U2.6), CONNECTORs (R37.2)
NetR38_2: I2C SWITCH (U2.8), CONNECTORs (R38.2)
NetR39_2: I2C SWITCH (U2.10), CONNECTORs (R39.2)
NetR40_2: I2C SWITCH (U2.7), CONNECTORs (R40.2)
NetR42_2: I2C SWITCH (U2.9), CONNECTORs (R42.2)
NetR44_2: I2C SWITCH (U2.11), CONNECTORs (R44.2)
NetR46_2: MICROCONTROLLER (U5.22), CONNECTORs (R46.2)
NetR47_2: MICROCONTROLLER (U5.27), CONNECTORs (R47.2)
NetR48_2: MICROCONTROLLER (U5.36), CONNECTORs (R48.2)
NetR49_2: I2C SWITCH (U2.13), CONNECTORs (R49.2)
NetR50_2: I2C SWITCH (U2.15), CONNECTORs (R50.2)
NetR51_2: I2C SWITCH (U2.17), CONNECTORs (R51.2)
NetR52_2: I2C SWITCH (U2.14), CONNECTORs (R52.2)
NetR54_2: I2C SWITCH (U2.16), CONNECTORs (R54.2)
NetR56_2: I2C SWITCH (U2.18), CONNECTORs (R56.2)
NetR58_2: MICROCONTROLLER (U5.41), CONNECTORs (R58.2)
NetR59_2: MICROCONTROLLER (U5.55), CONNECTORs (R59.2)
NetR60_2: MICROCONTROLLER (U5.60), CONNECTORs (R60.2)
NetR61_2: I2C SWITCH (U2.19), CONNECTORs (R61.2)
NetR62_2: I2C SWITCH (U3.4), CONNECTORs (R62.2)
NetR63_2: I2C SWITCH (U3.6), CONNECTORs (R63.2)
NetR64_2: I2C SWITCH (U2.20), CONNECTORs (R64.2)
NetR66_2: I2C SWITCH (U3.5), CONNECTORs (R66.2)
NetR68_2: I2C SWITCH (U3.7), CONNECTORs (R68.2)
NetR70_2: MICROCONTROLLER (U5.67), CONNECTORs (R70.2)
NetR71_2: MICROCONTROLLER (U5.65), CONNECTORs (R71.2)
NetR72_2: MICROCONTROLLER (U5.76), CONNECTORs (R72.2)
NetR73_2: I2C SWITCH (U3.8), CONNECTORs (R73.2)
NetR74_2: I2C SWITCH (U3.10), CONNECTORs (R74.2)
NetR75_2: I2C SWITCH (U3.13), CONNECTORs (R75.2)
NetR76_2: I2C SWITCH (U3.9), CONNECTORs (R76.2)
NetR78_2: I2C SWITCH (U3.11), CONNECTORs (R78.2)
NetR80_2: I2C SWITCH (U3.14), CONNECTORs (R80.2)
NetR82_2: MICROCONTROLLER (U5.79), CONNECTORs (R82.2)
NetR83_2: MICROCONTROLLER (U5.80), CONNECTORs (R83.2)
NetR84_2: MICROCONTROLLER (U5.88), CONNECTORs (R84.2)
NetR85_2: I2C SWITCH (U3.15), CONNECTORs (R85.2)
NetR86_2: I2C SWITCH (U3.17), CONNECTORs (R86.2)
NetR87_2: I2C SWITCH (U3.19), CONNECTORs (R87.2)
NetR88_2: I2C SWITCH (U3.16), CONNECTORs (R88.2)
NetR90_2: I2C SWITCH (U3.18), CONNECTORs (R90.2)
NetR92_2: I2C SWITCH (U3.20), CONNECTORs (R92.2)
NetR94_2: MICROCONTROLLER (U5.91), CONNECTORs (R94.2)
NetR95_2: MICROCONTROLLER (U5.96), CONNECTORs (R95.2)
NetR96_2: MICROCONTROLLER (U5.102), CONNECTORs (R96.2)
NetR97_2: I2C SWITCH (U4.4), CONNECTORs (R97.2)
NetR98_2: I2C SWITCH (U4.6), CONNECTORs (R98.2)
NetR99_2: I2C SWITCH (U4.8), CONNECTORs (R99.2)
NetR100_2: I2C SWITCH (U4.5), CONNECTORs (R100.2)
NetR102_2: I2C SWITCH (U4.7), CONNECTORs (R102.2)
NetR104_2: I2C SWITCH (U4.9), CONNECTORs (R104.2)
NetR106_2: MICROCONTROLLER (U5.110), CONNECTORs (R106.2)
NetR107_2: MICROCONTROLLER (U5.114), CONNECTORs (R107.2)
NetR108_2: MICROCONTROLLER (U5.119), CONNECTORs (R108.2)
NetR147_2: MICROCONTROLLER (U5.73), MISC (R147.2)
NetR148_2: MICROCONTROLLER (U5.74), MISC (R148.2)
NetR149_2: MICROCONTROLLER (U5.98), MISC (R149.2 U7.2 U7.3)
NetR158_2: MICROCONTROLLER (U5.2), RGB LEDs (R158.2)
NetR168_2: MICROCONTROLLER (U5.19), RGB_LED_3 (R3001.2), MISC (R168.2)
NetU1_3: MICROCONTROLLER (U5.139), I2C SWITCH (U1.3)
NetU2_3: MICROCONTROLLER (U5.12), I2C SWITCH (U2.3)
NetU3_3: MICROCONTROLLER (U5.112), I2C SWITCH (U3.3)
NetU4_3: MICROCONTROLLER (U5.85), I2C SWITCH (U4.3)
RS485_N: MISC (D1.1 R1001.1 R_TERM.1 U7.7), CONNECTORs (INPUT.3 INPUT2.3)
RS485_P: MISC (D2.1 R1002.2 R_TERM.2 U7.6), CONNECTORs (INPUT.2 INPUT2.2)